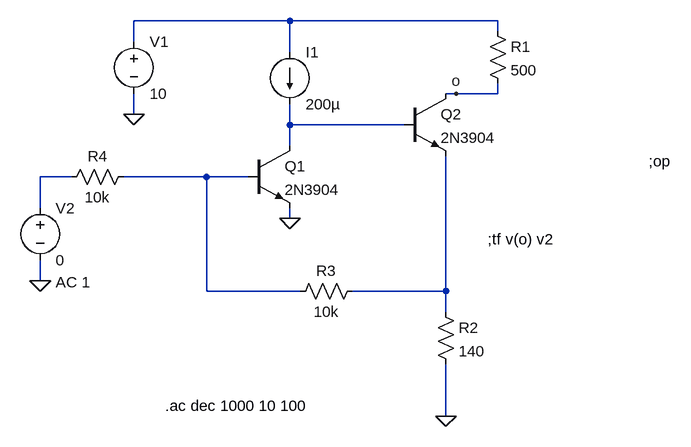
[diagram p0: schematic prueba real3.asc]
prueba real3.asc, the LTspice schematic file:
Version 4
SHEET 1 880 680
WIRE 208 -48 -32 -48
WIRE 528 -48 208 -48
WIRE 528 -32 528 -48
WIRE -32 -16 -32 -48
WIRE 208 0 208 -48
WIRE 464 64 448 64
WIRE 528 64 528 48
WIRE 528 64 464 64
WIRE -32 96 -32 64
WIRE 208 112 208 80
WIRE 352 112 208 112
WIRE 384 112 352 112
WIRE 208 144 208 112
WIRE -128 192 -176 192
WIRE 80 192 -48 192
WIRE 96 192 80 192
WIRE 144 192 96 192
WIRE -176 240 -176 192
WIRE 208 256 208 240
WIRE 448 272 448 160
WIRE -176 352 -176 320
WIRE 80 368 80 192
WIRE 224 368 80 368
WIRE 448 368 448 272
WIRE 448 368 304 368
WIRE 448 400 448 368
WIRE 448 560 448 480
FLAG -32 96 0
FLAG 208 256 0
FLAG 448 560 0
FLAG -176 352 0
FLAG 464 64 o
DATAFLAG 448 272 ""
DATAFLAG 96 192 ""
DATAFLAG 352 112 ""
DATAFLAG 528 64 ""
SYMBOL npn 144 144 R0
SYMATTR InstName Q1
SYMATTR Value 2N3904
SYMBOL npn 384 64 R0
SYMATTR InstName Q2
SYMATTR Value 2N3904
SYMBOL res 512 -48 R0
SYMATTR InstName R1
SYMATTR Value 500
SYMBOL current 208 0 R0
WINDOW 123 0 0 Left 2
WINDOW 39 0 0 Left 2
SYMATTR InstName I1
SYMATTR Value 200µ
SYMBOL voltage -32 -32 R0
WINDOW 123 0 0 Left 2
WINDOW 39 0 0 Left 2
SYMATTR InstName V1
SYMATTR Value 10
SYMBOL res 432 384 R0
SYMATTR InstName R2
SYMATTR Value 140
SYMBOL res 320 352 R90
WINDOW 0 0 56 VBottom 2
WINDOW 3 32 56 VTop 2
SYMATTR InstName R3
SYMATTR Value 10k
SYMBOL res -32 176 R90
WINDOW 0 0 56 VBottom 2
WINDOW 3 32 56 VTop 2
SYMATTR InstName R4
SYMATTR Value 10k
SYMBOL voltage -176 224 R0
WINDOW 123 24 130 Left 2
WINDOW 39 0 0 Left 2
SYMATTR Value2 AC 1
SYMATTR InstName V2
SYMATTR Value 0
TEXT 760 168 Left 2 !;op
TEXT 512 288 Left 2 !;tf v(o) v2
TEXT 16 544 Left 2 !.ac dec 1000 10 100

The netlist it stands for:
* prueba real3.asc
Q1 N002 N004 0 0 2N3904
Q2 o N002 N005 0 2N3904
R1 N001 o 500
I1 N001 N002 200µ
V1 N001 0 10
R2 N005 0 140
R3 N005 N004 10k
R4 N004 N003 10k
V2 N003 0 0 AC 1
.model NPN NPN
.model PNP PNP
.lib standard.bjt
;op
;tf v(o) v2
.ac dec 1000 10 100
.backanno
.end